# Altium schematic sheet Power_Supply_1.SchDoc
size A4; CompanyName: Technische Hochschule Nürnberg Georg Simon Ohm; Organization: UltraZohm; Address1: Kesslerplatz 12; Address2: 90489 Nürnberg; Address3: GERMANY; DocumentNumber: 10; SheetNumber: 10; SheetTotal: 12; Website: www.ultrazohm.com
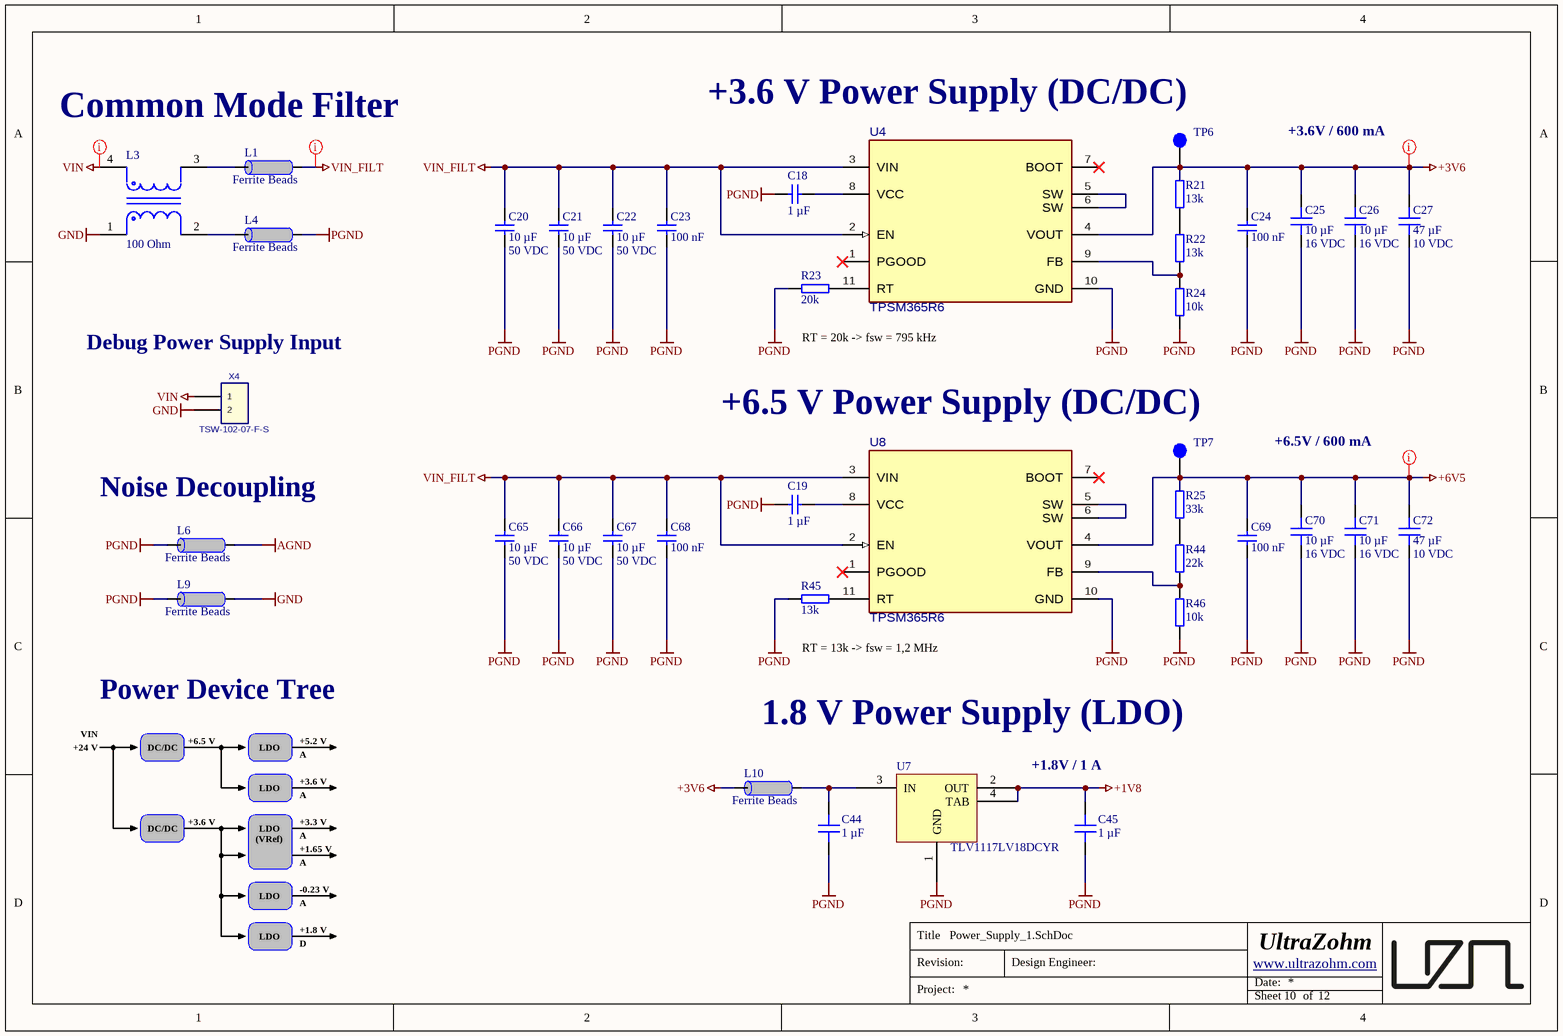
[diagram p0: Power_Supply_1.SchDoc]

## Parts
C18  1 µF  [C_0603_TE]
C19  1 µF  [C_0603_TE]
C20  10 µF  Voltage Rating: 50 VDC  [C_1206_TE]
C21  10 µF  Voltage Rating: 50 VDC  [C_1206_TE]
C22  10 µF  Voltage Rating: 50 VDC  [C_1206_TE]
C23  100 nF  [C_0603_TE]
C24  100 nF  [C_0603_TE]
C25  10 µF  Voltage Rating: 16 VDC  [C_0603_TE]
C26  10 µF  Voltage Rating: 16 VDC  [C_0603_TE]
C27  47 µF  Voltage Rating: 10 VDC  [C_1210_N]
C44  1 µF  [C_0603]
C45  1 µF  [C_0603]
C65  10 µF  Voltage Rating: 50 VDC  [C_1206_TE]
C66  10 µF  Voltage Rating: 50 VDC  [C_1206_TE]
C67  10 µF  Voltage Rating: 50 VDC  [C_1206_TE]
C68  100 nF  [C_0603_TE]
C69  100 nF  [C_0603_TE]
C70  10 µF  Voltage Rating: 16 VDC  [C_0603_TE]
C71  10 µF  Voltage Rating: 16 VDC  [C_0603_TE]
C72  47 µF  Voltage Rating: 10 VDC  [C_1210_N]
L1  Component Type: Ferrite Beads  [INDC2012X92N_V]  (hidden comment: UPZ2012E601-2R0TF)
L3  100 Ohm  [FP-DLW5BT-MFG]
L4  Component Type: Ferrite Beads  [INDC2012X92N_V]  (hidden comment: UPZ2012E601-2R0TF)
L6  Component Type: Ferrite Beads  [INDC2012X92N_V]  (hidden comment: UPZ2012E601-2R0TF)
L9  Component Type: Ferrite Beads  [INDC2012X92N_V]  (hidden comment: UPZ2012E601-2R0TF)
L10  Component Type: Ferrite Beads  [INDC2012X92N_V]  (hidden comment: UPZ2012E601-2R0TF)
R21  13k  [R_0402_TE]
R22  13k  [R_0402_TE]
R23  20k  [R_0402_TE]
R24  10k  [R_0402_TE]
R25  33k  [R_0402_TE]
R44  22k  [R_0402_TE]
R45  13k  [R_0402_TE]
R46  10k  [R_0402_TE]
TP6  Testpoint 1mm  [TP_1mm]  (value not drawn)  (no BOM)
TP7  Testpoint 1mm  [TP_1mm]  (value not drawn)  (no BOM)
U4  TPSM365R6  [RDN0011A-MFG]
U7  TLV1117LV18DCYR  [SOT230P700X170-4N]
U8  TPSM365R6  [RDN0011A-MFG]
X4  TSW-102-07-F-S  [TSW-102-XX-XXX-S]

## Nets
+1V8: C45.2 U7.2(OUT) U7.4(TAB)
+3V6: C24.2 C25.2 C26.2 C27.2 L10.2 R21.2 TP6.1 U4.4(VOUT)
+6V5: C69.2 C70.2 C71.2 C72.2 R25.2 TP7.1 U8.4(VOUT)
AGND: L6.1
GND: L3.1 L9.1 X4.2
PGND: C18.1 C19.1 C20.2 C21.2 C22.2 C23.1 C24.1 C25.1 C26.1 C27.1 C44.1 C45.1 C65.1 C66.1 C67.1 C68.1 C69.1 C70.1 C71.1 C72.1 L4.1 L6.2 L9.2 R23.1 R24.1 R45.1 R46.1 U4.10(GND) U7.1(GND) U8.10(GND)
VIN: L3.4 X4.1
VIN_FILT: C20.1 C21.1 C22.1 C23.2 C65.2 C66.2 C67.2 C68.2 L1.1 U4.2(EN) U4.3(VIN) U8.2(EN) U8.3(VIN)
NetC18_2: C18.2 U4.8(VCC)
NetC19_2: C19.2 U8.8(VCC)
NetC44_2: C44.2 L10.1 U7.3(IN)
NetL1_2: L1.2 L3.3
NetL3_2: L3.2 L4.2
NetR21_1: R21.1 R22.2
NetR22_1: R22.1 R24.2 U4.9(FB)
NetR23_2: R23.2 U4.11(RT)
NetR25_1: R25.1 R44.2
NetR44_1: R44.1 R46.2 U8.9(FB)
NetR45_2: R45.2 U8.11(RT)
NetU4_5: U4.5(SW) U4.6(SW)
NetU8_5: U8.5(SW) U8.6(SW)

Not connected (* = marked no-connect by the designer): U4 1(PGOOD)* 7(BOOT)*; U8 1(PGOOD)* 7(BOOT)*

## Layout directives
net class PWR: +3V6, +6V5, VIN, VIN_FILT

## Notes on the sheet
- (near TP6) +3.6 V Power Supply (DC/DC)
- Common Mode Filter
- +3.6V / 600 mA
- (near X4) Debug Power Supply Input
- RT = 20k -> fsw = 795 kHz
- (near TP7) +6.5 V Power Supply (DC/DC)
- +6.5V / 600 mA
- Noise Decoupling
- Power Device Tree
- RT = 13k -> fsw = 1,2 MHz
- +24 V
- VIN
- DC/DC
- +6.5 V
- LDO
- +5.2 V
- +3.6 V
- A
- 1.8 V Power Supply (LDO)
- +1.8V / 1 A
- (VRef)
- +1.65 V
- +3.3 V
- -0.23 V
- +1.8 V
- D
- Title
- Revision:
- Design Engineer:
- Date:
- Project:
- Sheet
- of

## Library data of the parts
C18 C19 = UZgen_C_0603_1uF_16V_X7R: Generic capacitor; Manufacturer: UZgen; Voltage: 16V; Tolerance: 10 %; Created from: UZgenTool; Technology: X7R; Value: 1 µF; Manufacturer Part Number: UZgen_C_0603_1uF_16V_X7R; PartID: 3783; Created On: 02.08.2024 11:17:59; Device Package: 0603; Mounting Type: SMD; Last Updated: 02.08.2024 11:17:59
C20-C22 C65-C67 = CL31B106KBHNNNE: 50V 10uF X7R ±10% 1206  Multilayer Ceramic Capacitors MLCC - SMD/SMT ROHS; Manufacturer: Samsung Electro-Mechanics; Created from: AGeiger; Manufacturer Part Number: CL31B106KBHNNNE; PartID: 107; Created On: 20.09.2022 20:14:50; ComponentLink1Description: Datasheet; ComponentLink1URL: https://datasheet.lcsc.com/lcsc/1810221111_Samsung-Electro-Mechanics-CL31B106KBHNNNE_C89632.pdf; Component Type: Capacitor 1206; Device Package: 1206; Last Updated: 08.08.2024 12:57:34; Mounting Type: SMD; Operating Temperature: -55 - 125°C; Series: X7R; Supplier 1: LCSC; Supplier Part Number 1: C89632; Type: Capacitor; Tolerance: 10 %; Value: 10 µF; Live Cycle Status: 1; LCSC Part Number: C89632; Supplier 2: Mouser; Supplier Part Number 2: 187-CL31B106KBHNNNE
C23 C24 C68 C69 = UZgen_C_0603_100nF_50V_X7R: Generic capacitor; Manufacturer: UZgen; Tolerance: 10 %; Created from: AGeiger; Voltage: 50V; Manufacturer Part Number: UZgen_C_0603_100nF_50V_X7R; PartID: 1; Created On: 02.07.2024 14:42:23; Device Package: 0603; Last Updated: 08.08.2024 15:01:15; Mounting Type: SMD; Value: 100 nF; Technology: X7R
C25 C26 C70 C71 = CL10A106MO8NQNC: Capacitor 0603, 16 VDC, 10 µF, X5R; Manufacturer: Samsung Electro-Mechanics; Tolerance: 20 %; Created from: AGeiger; Manufacturer Part Number: CL10A106MO8NQNC; PartID: 101; Created On: 22.08.2022 13:56:44; ComponentLink1Description: Datasheet; ComponentLink1URL: https://datasheet.lcsc.com/lcsc/1810261909_Samsung-Electro-Mechanics-CL10A106MO8NQNC_C92487.pdf; Component Type: Capacitor 0603; Device Package: 0603; Last Updated: 19.11.2024 12:34:06; Mounting Type: SMD; Operating Temperature: -55 - 85°C; Supplier 1: LCSC; Supplier Part Number 1: C92487; Type: Capacitor; Value: 10 µF; Live Cycle Status: 1; LCSC Part Number: C92487; Series: X5R
C27 C72 = GRM32ER71A476KE15L: 10V 47uF X7R ±10% 1210  Multilayer Ceramic Capacitors MLCC - SMD/SMT ROHS; Manufacturer: Murata Electronics; Created from: AGeiger; Manufacturer Part Number: GRM32ER71A476KE15L; PartID: 111; Created On: 21.09.2022 16:18:50; ComponentLink1Description: Datasheet; ComponentLink1URL: https://datasheet.lcsc.com/lcsc/1811071031_Murata-Electronics-GRM32ER71A476KE15L_C84494.pdf; Component Type: Capacitor 1210; Device Package: 1210; Last Updated: 21.09.2022 16:18:50; Mounting Type: SMD; Operating Temperature: -55 - 125°C; Series: GRM; Supplier 1: LCSC; Supplier Part Number 1: C84494; Type: Capacitor; Tolerance: 10 %; Value: 47 µF; Live Cycle Status: 1; LCSC Part Number: C84494
C44 C45 = UMK107AB7105KA-T: 50V 1uF X7R ±10% 0603 Multilayer Ceramic Capacitors MLCC - SMD/SMT ROHS; Manufacturer: Taiyo Yuden; Voltage Rating: 50 VDC; Created from: NDiringer; Manufacturer Part Number: UMK107AB7105KA-T; PartID: 98; Created On: 09.08.2022 09:35:02; ComponentLink1Description: Datasheet; ComponentLink1URL: https://www.mouser.de/datasheet/2/396/mlcc02_e-1307760.pdf; Component Type: Capacitor 0603; Device Package: 0603; Last Updated: 21.09.2022 16:11:37; Mounting Type: SMD; Operating Temperature: -55 - 125°C; Series: X7R; Supplier 1: LCSC; Supplier Part Number 1: C105174; Supplier 2: Mouser; Supplier Part Number 2: 963-UMK107AB7105MA-T; Type: Capacitor; Tolerance: 10 %; Value: 1 µF; Live Cycle Status: 1; LCSC Part Number: C105174; Stock number: not stored
L1 L4 L6 L9 L10 = UPZ2012E601-2R0TF: 2A 1 90mΩ 600Ω@100MHz ±25% 0805  Ferrite Beads ROHS; Manufacturer: Sunlord; Value: 90 Ohm; Created from: AGeiger; Manufacturer Part Number: UPZ2012E601-2R0TF; PartID: 11; Created On: 03.09.2022 16:57:01; ComponentLink1Description: Datasheet; ComponentLink1URL: https://datasheet.lcsc.com/lcsc/2110091730_Sunlord-UPZ2012E601-2R0TF_C98308.pdf; Device Package: 0805; Last Updated: 03.09.2022 17:01:04; Mounting Type: SMD; Operating Temperature: -55 - 125 °C; Supplier 1: LCSC; Supplier Part Number 1: C98308; Type: Ferrite Bead; DC current: 2 A; Live Cycle Status: 1; LCSC Part Number: C98308
L3 = DLW5BTH142TQ2L: -40℃~125℃ 1.5A 56mΩ 50V 100Ω @ 10MHz 125VDC SMD,5x5mm Common Mode Filters ROHS; Manufacturer: Murata; Type: Common Mode Choke; Created from: AGeiger; Manufacturer Part Number: DLW5BTH142TQ2L; PartID: 13; Created On: 18.10.2022 16:07:46; ComponentLink1Description: Datasheet; ComponentLink1URL: https://datasheet.lcsc.com/lcsc/1912111437_Murata-Electronics-DLW5BTH142TQ2L_C393166.pdf; Component Type: Common Mode Choke; Device Package: SMD,5x5mm; Last Updated: 14.08.2025 08:46:24; Mounting Type: SMD; Operating Temperature: -40 to +125 °C; Series: DLW; Supplier 1: LCSC; Supplier Part Number 1: C393166; DC current: 1.5A; Value: 100 Ohm; Live Cycle Status: 1; LCSC Part Number: C393166
R21 R22 R45 = UZgen_R_0402_13k: Generic resistor; Manufacturer: UZgen; Tolerance: 1 %; Created from: UZgenTool; Manufacturer Part Number: UZgen_R_0402_13k; PartID: 104; Created On: 02.07.2024 17:29:46; Value: 13k; Device Package: 0402; Mounting Type: SMD; Last Updated: 02.07.2024 17:29:46
R23 = UZgen_R_0402_20k: Generic resistor; Manufacturer: UZgen; Tolerance: 1 %; Created from: UZgenTool; Manufacturer Part Number: UZgen_R_0402_20k; PartID: 108; Created On: 02.07.2024 17:29:46; Value: 20k; Device Package: 0402; Mounting Type: SMD; Last Updated: 02.07.2024 17:29:46
R24 R46 = UZgen_R_0402_10k: Generic resistor; Manufacturer: UZgen; Tolerance: 1 %; Created from: UZgenTool; Manufacturer Part Number: UZgen_R_0402_10k; PartID: 101; Created On: 02.07.2024 17:29:46; Value: 10k; Device Package: 0402; Mounting Type: SMD; Last Updated: 02.07.2024 17:29:46
R25 = UZgen_R_0402_33k: Generic resistor; Manufacturer: UZgen; Tolerance: 1 %; Created from: UZgenTool; Manufacturer Part Number: UZgen_R_0402_33k; PartID: 113; Created On: 02.07.2024 17:29:47; Value: 33k; Device Package: 0402; Mounting Type: SMD; Last Updated: 02.07.2024 17:29:47
R44 = UZgen_R_0402_22k: Generic resistor; Manufacturer: UZgen; Tolerance: 1 %; Created from: UZgenTool; Manufacturer Part Number: UZgen_R_0402_22k; PartID: 109; Created On: 02.07.2024 17:29:46; Value: 22k; Device Package: 0402; Mounting Type: SMD; Last Updated: 02.07.2024 17:29:46
TP6 TP7 = Testpoint_1mm: Manufacturer: UltraZohm; Created from: AGeiger; Created: 2018_06_25_AGeiger; Value: Testpoint 1mm; Manufacturer Part Number: Testpoint_1mm; PartID: 9; Created On: 20.09.2022 13:14:57; Component Type: Testpoint; Last Updated: 14.08.2025 11:47:07; Supplier 1: NULL; Supplier Part Number 1: NULL; Type: Testpoint; Live Cycle Status: 1
U4 U8 = TPSM365R6FRDNR: 3-V to 65-V input, 1-V to 13-V output, 0.6-A synchronous buck converter power module; Manufacturer: Texas Instruments; Created from: AGeiger; Manufacturer Part Number: TPSM365R6FRDNR; PartID: 42; Created On: 16.06.2025 17:12:20; ComponentLink1Description: Datasheet; ComponentLink1URL: https://www.ti.com/lit/ds/symlink/tpsm365r3.pdf?ts=1747982141267; Component Type: Power module with inductor; Device Package: QFN-FCMOD; Last Updated: 26.09.2025 12:26:17; Mounting Type: SMD; Operating Temperature: -40 to +125 °C; Series: TPSM365; Supplier 1: LCSC; Supplier Part Number 1: C6723000; Type: Power module (integrated inductor); Value: TPSM365R6; Live Cycle Status: 1; LCSC Part Number: C6723000; Stock number: not stored; Supplier 2: Mouser; Supplier Part Number 2: 595-TPSM365R6FRDNR
U7 = TLV1117LV18DCYR: 1-A, Positive Fixed-Voltage, Low-Dropout Regulator; MF: Texas Instruments; Voltage Output: 1.8 V; Voltage Input Max: 5.5 V; Current Max: 1 A; Value: 1.8V; Created from: AGeiger; MPN: TLV1117LV18DCYR; Supplier 1: LCSC; Supplier Part Number 1: C80105; Manufacturer Part Number: TLV1117LV18DCYR; PartID: 23; Created On: 28.11.2022 16:53:03; ComponentLink1Description: Datasheet; ComponentLink1URL: https://www.ti.com/lit/ds/symlink/tlv1117lv.pdf?HQS=dis-mous-null-mousermode-dsf-pf-null-wwe&ts=1669592607754&ref_url=https%253A%252F%252Fwww.mouser.de%252F; Component Type: Low Dropout Regulator; Device Package: SOT-223; Last Updated: 28.11.2022 16:53:03; Manufacturer: Texas Instruments; Mounting Type: SMD; Operating Temperature: -40 to +125 °C; Type: Low Dropout Regulator; Live Cycle Status: 1; LCSC Part Number: C80105; Stock number: not stored
X4 = TSW-102-07-F-S: Pin Header, 2.54mm, 2x1; MANUFACTURER: SAMTEC; Created from: AGeiger; Number of positions: 2; CREATED BY: May 18, 2016 - Wendy Xin; PCB DECAL: TSW-102-XX-XXX-S; Manufacturer Part Number: TSW-102-07-F-S; PartID: 13; Created On: 02.12.2022 15:20:24; ComponentLink1Description: Datasheet; ComponentLink1URL: https://suddendocs.samtec.com/catalog_english/tsw_th.pdf; Component Type: Pin Header; Device Package: THT; Last Updated: 02.12.2022 15:20:30; Mounting Type: THT; Operating Temperature: -55 to +125 °C; Series: TSW; Supplier 1: Mouser; Supplier Part Number 1: 200-TSW10207FS; Type: Pin Header; Live Cycle Status: 1; Stock number: not stored; Number of rows: 1